# EAGLE schematic tempix_main (EAGLE 7.2.0)
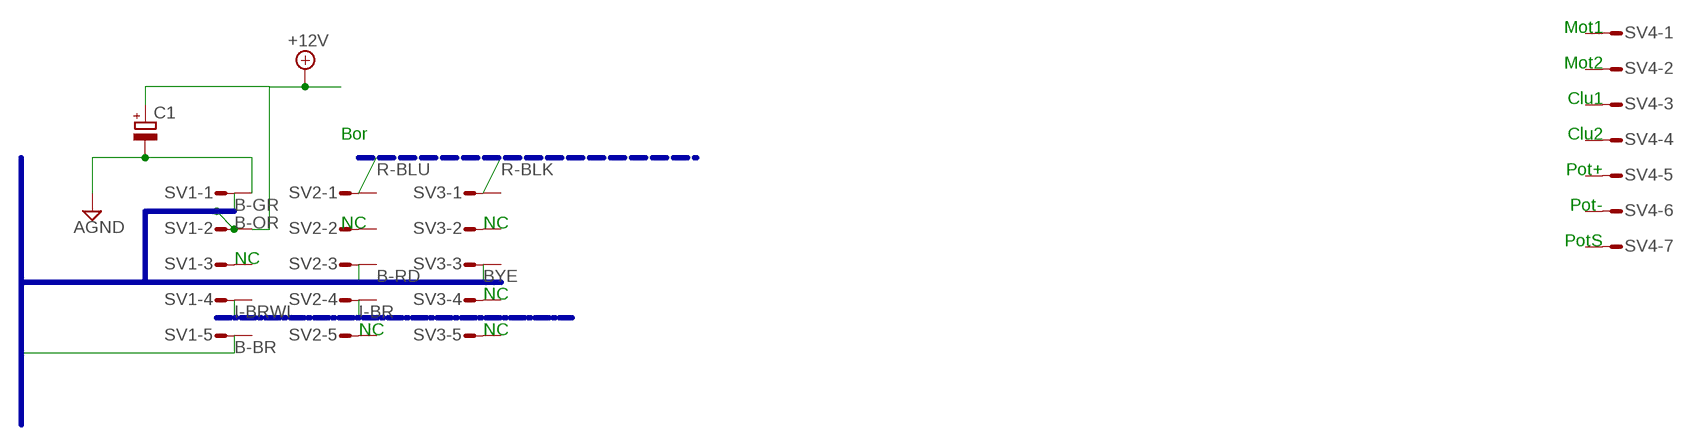
[diagram p0: schematic, sheet 1]

## Parts
C1  CPOL-EUE10-30  [EB30D]
SV1  L05P  [L05P]
SV2  L05P  [L05P]
SV3  L05P  [L05P]
SV4  L07P  [L07P]

## Nets
+12V: C1.+ SV1.2
AGND: C1.- SV1.1
Unconnected: SV1.3 SV1.4 SV1.5 SV2.1 SV2.2 SV2.3 SV2.4 SV2.5 SV3.1 SV3.2 SV3.3 SV3.4 SV3.5 SV4.1 SV4.2 SV4.3 SV4.4 SV4.5 SV4.6 SV4.7

## Buses
HMI
RMP
BRK-CLU

## Notes on the sheet
- Mot1
- Mot2
- Clu1
- Bor | Clu2
- Pot+
- Pot-
- NC | NC
- PotS
- NC
- NC
- NC | NC

## Library data of the parts
C1 = resistor:CPOL-EU: POLARIZED CAPACITOR, European symbol
SV1-SV3 = con-amp-mt:L05P: AMP MT CONNECTOR; OC_FARNELL: unknown; OC_NEWARK: unknown
SV4 = con-amp-mt:L07P: AMP MT CONNECTOR; OC_FARNELL: unknown; OC_NEWARK: unknown